# Altium schematic sheet ACCELEROMETER.SchDoc
size A
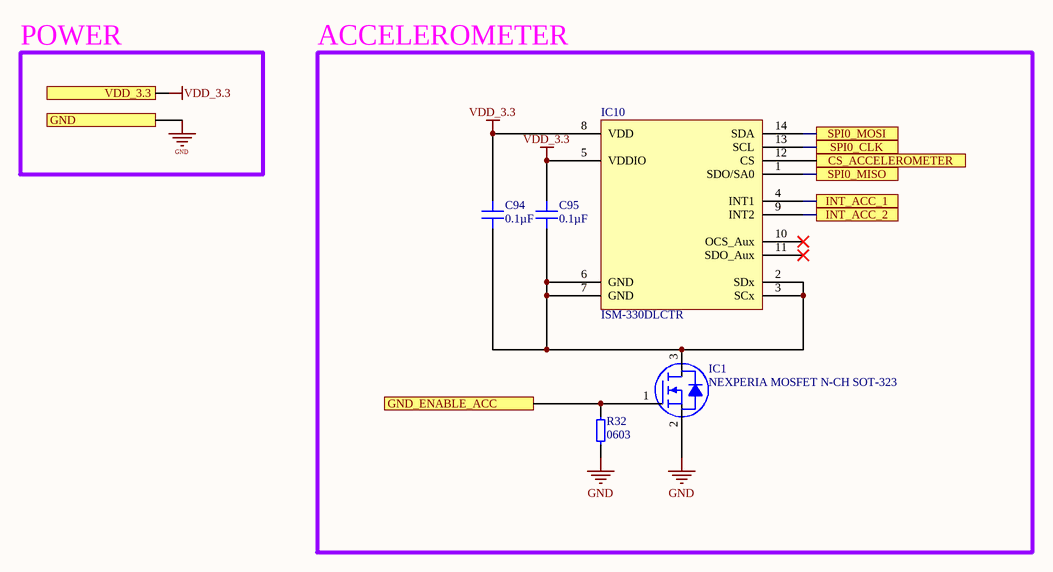
[diagram p0: ACCELEROMETER.SchDoc]

## Parts
C94  0.1µF  [CAP 0603_1608 RF]
C95  0.1µF  [CAP 0603_1608 RF]
IC1  NEXPERIA MOSFET N-CH SOT-323  [NEXPERIA SOT-323]
IC10  ISM-330DLCTR  [14LGA (2.5MM x 3.0MM)]
R32  0603  [0603_1608 RF]  (no BOM)

## Blocks framed on the sheet
ACCELEROMETER: C94 C95 IC1 IC10 R32

## Ports
CS_ACCELEROMETER, GND, GND_ENABLE_ACC, INT_ACC_1, INT_ACC_2, SPI0_CLK, SPI0_MISO, SPI0_MOSI, VDD_3.3

## Nets
GND: IC1.2(S) R32.1 ; port GND
VDD_3.3: C94.2 C95.2 IC10.5(VDDIO) IC10.8(VDD) ; port VDD_3.3
CS_ACCELEROMETER: IC10.12(CS) ; port CS_ACCELEROMETER
GND_ENABLE_ACC: IC1.1(G) R32.2 ; port GND_ENABLE_ACC
INT_ACC_1: IC10.4(INT1) ; port INT_ACC_1
INT_ACC_2: IC10.9(INT2) ; port INT_ACC_2
SPI0_CLK: IC10.13(SCL) ; port SPI0_CLK
SPI0_MISO: IC10.1(SDO/SA0) ; port SPI0_MISO
SPI0_MOSI: IC10.14(SDA) ; port SPI0_MOSI
NetC94_1: C94.1 C95.1 IC1.3(D) IC10.2(SDx) IC10.3(SCx) IC10.6(GND) IC10.7(GND)

Not connected (* = marked no-connect by the designer): IC10 10(OCS_Aux)* 11(SDO_Aux)*

## Notes on the sheet
- POWER

## Library data of the parts
C94 C95 = CAP00039: CAP CER 0.1UF 16V X7R 0603; Manufacturer: KEMET; Manufacturer P/N: C0603C104M4RACAUTO; Tolerance: ±20%; Device ID: CAP00039; Mounting Type: Surface Mount; Part Type: Capacitor; VALUE: 0.1µF; Operating Temperature: -55°C ~ 125°C; Voltage: 16V; Package: 0603 (1608 Metric); Supplier1: Digi-Key; Supplier1 P/N: 399-C0603C104M4RACAUTOCT-ND; Supplier2: Mouser; Supplier2 P/N: C0603C104M4RACAUTO; Temperature Coefficient: X7R
IC1 = MOS00000: MOSFET N-CH 60V 320MA SOT323; Manufacturer: Nexperia USA Inc.; Manufacturer P/N: BSS138PW,115; FET Type: N-Channel; VALUE: NFET; Current - Continuous Drain (Id) @ 25°C: 320mA (Ta); Drive Voltage (Max Rds On, Min Rds On): 10V; Rds On (Max) @ Id, Vgs: 1.6Ohm @ 300mA, 10V; Vgs(th) (Max) @ Id: 1.5V @ 250µA; Vgs (Max): ±20V; Power Dissipation (Max): 260mW (Ta), 830mW (Tc); Gate Charge (Qg) (Max) @ Vgs: 0.8 nC @ 4.5 V; Input Capacitance (Ciss) (Max) @ Vds: 50 pF @ 10 V; Device ID: MOS00000; Package: SOT-323; Part Type: IC; Technology: MOSFET (Metal Oxide); FET Feature: -; Operating Temperature: -55°C ~ 150°C (TA); Mounting Type: Surface Mount; Drain to Source Voltage (Vdss): 60V; Supplier1: Digi-Key; Supplier1 P/N: 1727-1143-1-ND; Supplier2: Mouser; Supplier2 P/N: 771-BSS138PW115
IC10 = ACC00001: INEMO INERTIAL MODULE; Manufacturer: STMicroelectronics; Manufacturer P/N: ISM330DLCTR; VALUE: MEMS Acceleromter; Acceleration Range: ±2g, 4g, 8g, 16g; Voltage Supply: 1.71V ~ 3.6V; Output Type: I²C, SPI; Bandwidth: 3.332kHz; Axis: X, Y, Z; Sensitivity (LSB/g): 16384 (±2g) ~ 2048 (±16g); Device ID: ACC00001; Part Type: IC; Operating Temperature: -40°C ~ 85°C; Package: 14-VFLGA; Supplier1: Digi-Key; Supplier1 P/N: 497-17583-1-ND; Supplier2: Mouser; Supplier2 P/N: 511-ISM330DLCTR; Mounting Type: Surface Mount
R32 = RFP00002: 0603 RF Passive; Device ID: RFP00002; VALUE: 0603; Mounting Type: Surface Mount; Part Type: Passive